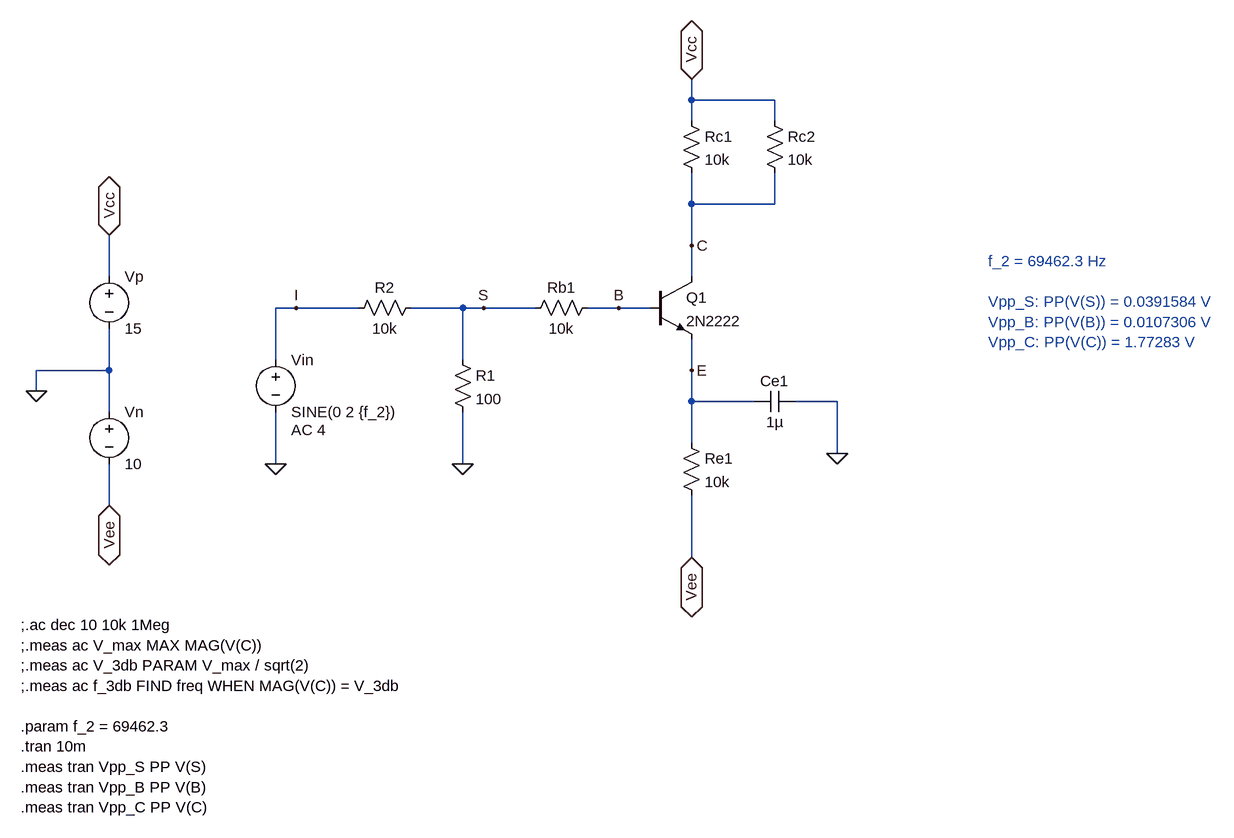
[diagram p0: schematic e3_1_d2.asc]
e3_1_d2.asc, the LTspice schematic file:
Version 4
SHEET 1 1936 868
WIRE 928 -208 928 -240
WIRE 1056 -208 928 -208
WIRE 928 -176 928 -208
WIRE 1056 -176 1056 -208
WIRE 928 -48 928 -96
WIRE 1056 -48 1056 -96
WIRE 1056 -48 928 -48
WIRE 928 16 928 -48
WIRE 32 64 32 0
WIRE 928 64 928 16
WIRE 320 112 288 112
WIRE 416 112 320 112
WIRE 576 112 496 112
WIRE 608 112 576 112
WIRE 688 112 608 112
WIRE 816 112 768 112
WIRE 864 112 816 112
WIRE 288 192 288 112
WIRE 576 192 576 112
WIRE 32 208 32 144
WIRE 32 208 -80 208
WIRE 928 208 928 160
WIRE -80 240 -80 208
WIRE 928 256 928 208
WIRE 1024 256 928 256
WIRE 1152 256 1088 256
WIRE 32 272 32 208
WIRE 928 320 928 256
WIRE 1152 336 1152 256
WIRE 288 352 288 272
WIRE 576 352 576 272
WIRE 32 416 32 352
WIRE 928 496 928 400
FLAG -80 240 0
FLAG 32 0 Vcc
IOPIN 32 0 BiDir
FLAG 32 416 Vee
IOPIN 32 416 BiDir
FLAG 288 352 0
FLAG 576 352 0
FLAG 928 -240 Vcc
IOPIN 928 -240 BiDir
FLAG 928 496 Vee
IOPIN 928 496 BiDir
FLAG 1152 336 0
FLAG 320 112 I
FLAG 608 112 S
FLAG 816 112 B
FLAG 928 208 E
FLAG 928 16 C
SYMBOL voltage 32 48 R0
SYMATTR InstName Vp
SYMATTR Value 15
SYMBOL voltage 32 256 R0
SYMATTR InstName Vn
SYMATTR Value 10
SYMBOL res 560 176 R0
SYMATTR InstName R1
SYMATTR Value 100
SYMBOL res 400 128 R270
WINDOW 0 32 56 VTop 2
WINDOW 3 0 56 VBottom 2
SYMATTR InstName R2
SYMATTR Value 10k
SYMBOL res 672 128 R270
WINDOW 0 32 56 VTop 2
WINDOW 3 0 56 VBottom 2
SYMATTR InstName Rb1
SYMATTR Value 10k
SYMBOL npn 864 64 R0
SYMATTR InstName Q1
SYMATTR Value 2N2222
SYMBOL res 912 -192 R0
SYMATTR InstName Rc1
SYMATTR Value 10k
SYMBOL res 912 304 R0
SYMATTR InstName Re1
SYMATTR Value 10k
SYMBOL cap 1088 240 R90
WINDOW 0 0 32 VBottom 2
WINDOW 3 32 32 VTop 2
SYMATTR InstName Ce1
SYMATTR Value 1µ
SYMBOL voltage 288 176 R0
WINDOW 123 24 124 Left 2
WINDOW 39 0 0 Left 0
SYMATTR Value2 AC 4
SYMATTR InstName Vin
SYMATTR Value SINE(0 2 {f_2})
SYMBOL res 1040 -192 R0
SYMATTR InstName Rc2
SYMATTR Value 10k
TEXT -104 600 Left 2 !;.ac dec 10 10k 1Meg\n;.meas ac V_max MAX MAG(V(C))\n;.meas ac V_3db PARAM V_max / sqrt(2)\n;.meas ac f_3db FIND freq WHEN MAG(V(C)) = V_3db\n \n.param f_2 = 69462.3\n.tran 10m\n.meas tran Vpp_S PP V(S)\n.meas tran Vpp_B PP V(B)\n.meas tran Vpp_C PP V(C)
TEXT 1384 40 Left 2 ;f_2 = 69462.3 Hz\n \nVpp_S: PP(V(S)) = 0.0391584 V\nVpp_B: PP(V(B)) = 0.0107306 V\nVpp_C: PP(V(C)) = 1.77283 V

The netlist it stands for:
* e3_1_d2.asc
Vp Vcc 0 15
Vn 0 Vee 10
R1 S 0 100
R2 I S 10k
Rb1 S B 10k
Q1 C B E 0 2N2222
Rc1 Vcc C 10k
Re1 E Vee 10k
Ce1 0 E 1µ
Vin I 0 SINE(0 2 {f_2}) AC 4
Rc2 Vcc C 10k
.model NPN NPN
.model PNP PNP
.lib standard.bjt
;.ac dec 10 10k 1Meg
;.meas ac V_max MAX MAG(V(C))
;.meas ac V_3db PARAM V_max / sqrt(2)
;.meas ac f_3db FIND freq WHEN MAG(V(C)) = V_3db
.param f_2 = 69462.3
.tran 10m
.meas tran Vpp_S PP V(S)
.meas tran Vpp_B PP V(B)
.meas tran Vpp_C PP V(C)
* f_2 = 69462.3 Hz
* Vpp_S: PP(V(S)) = 0.0391584 V
* Vpp_B: PP(V(B)) = 0.0107306 V
* Vpp_C: PP(V(C)) = 1.77283 V
.backanno
.end